# Altium schematic sheet Sheet1.SchDoc
size A0
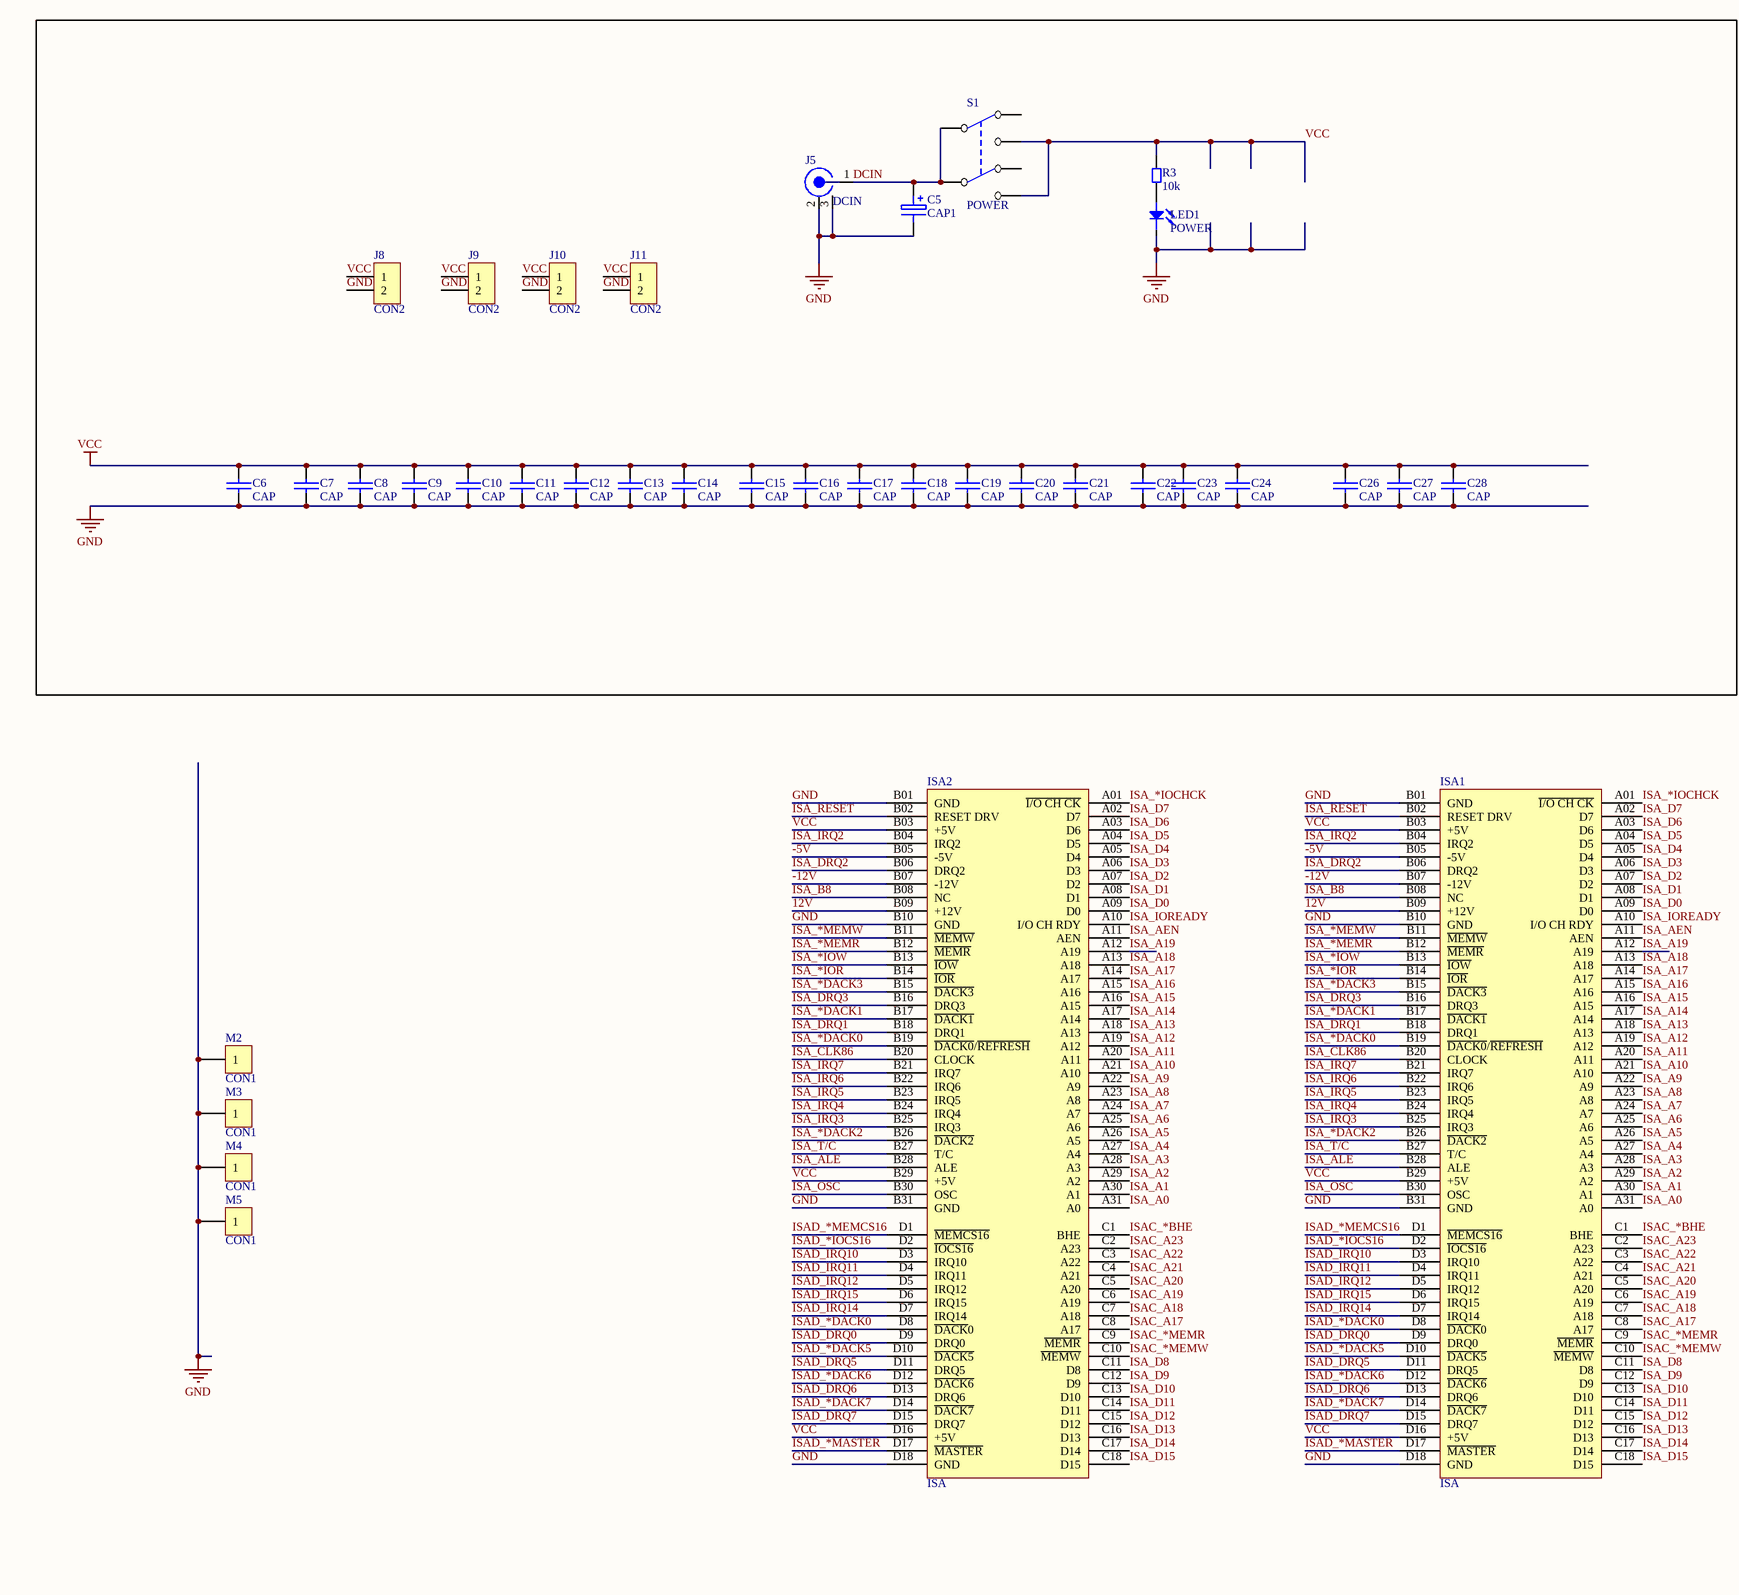
[diagram p0: Sheet1.SchDoc, left]
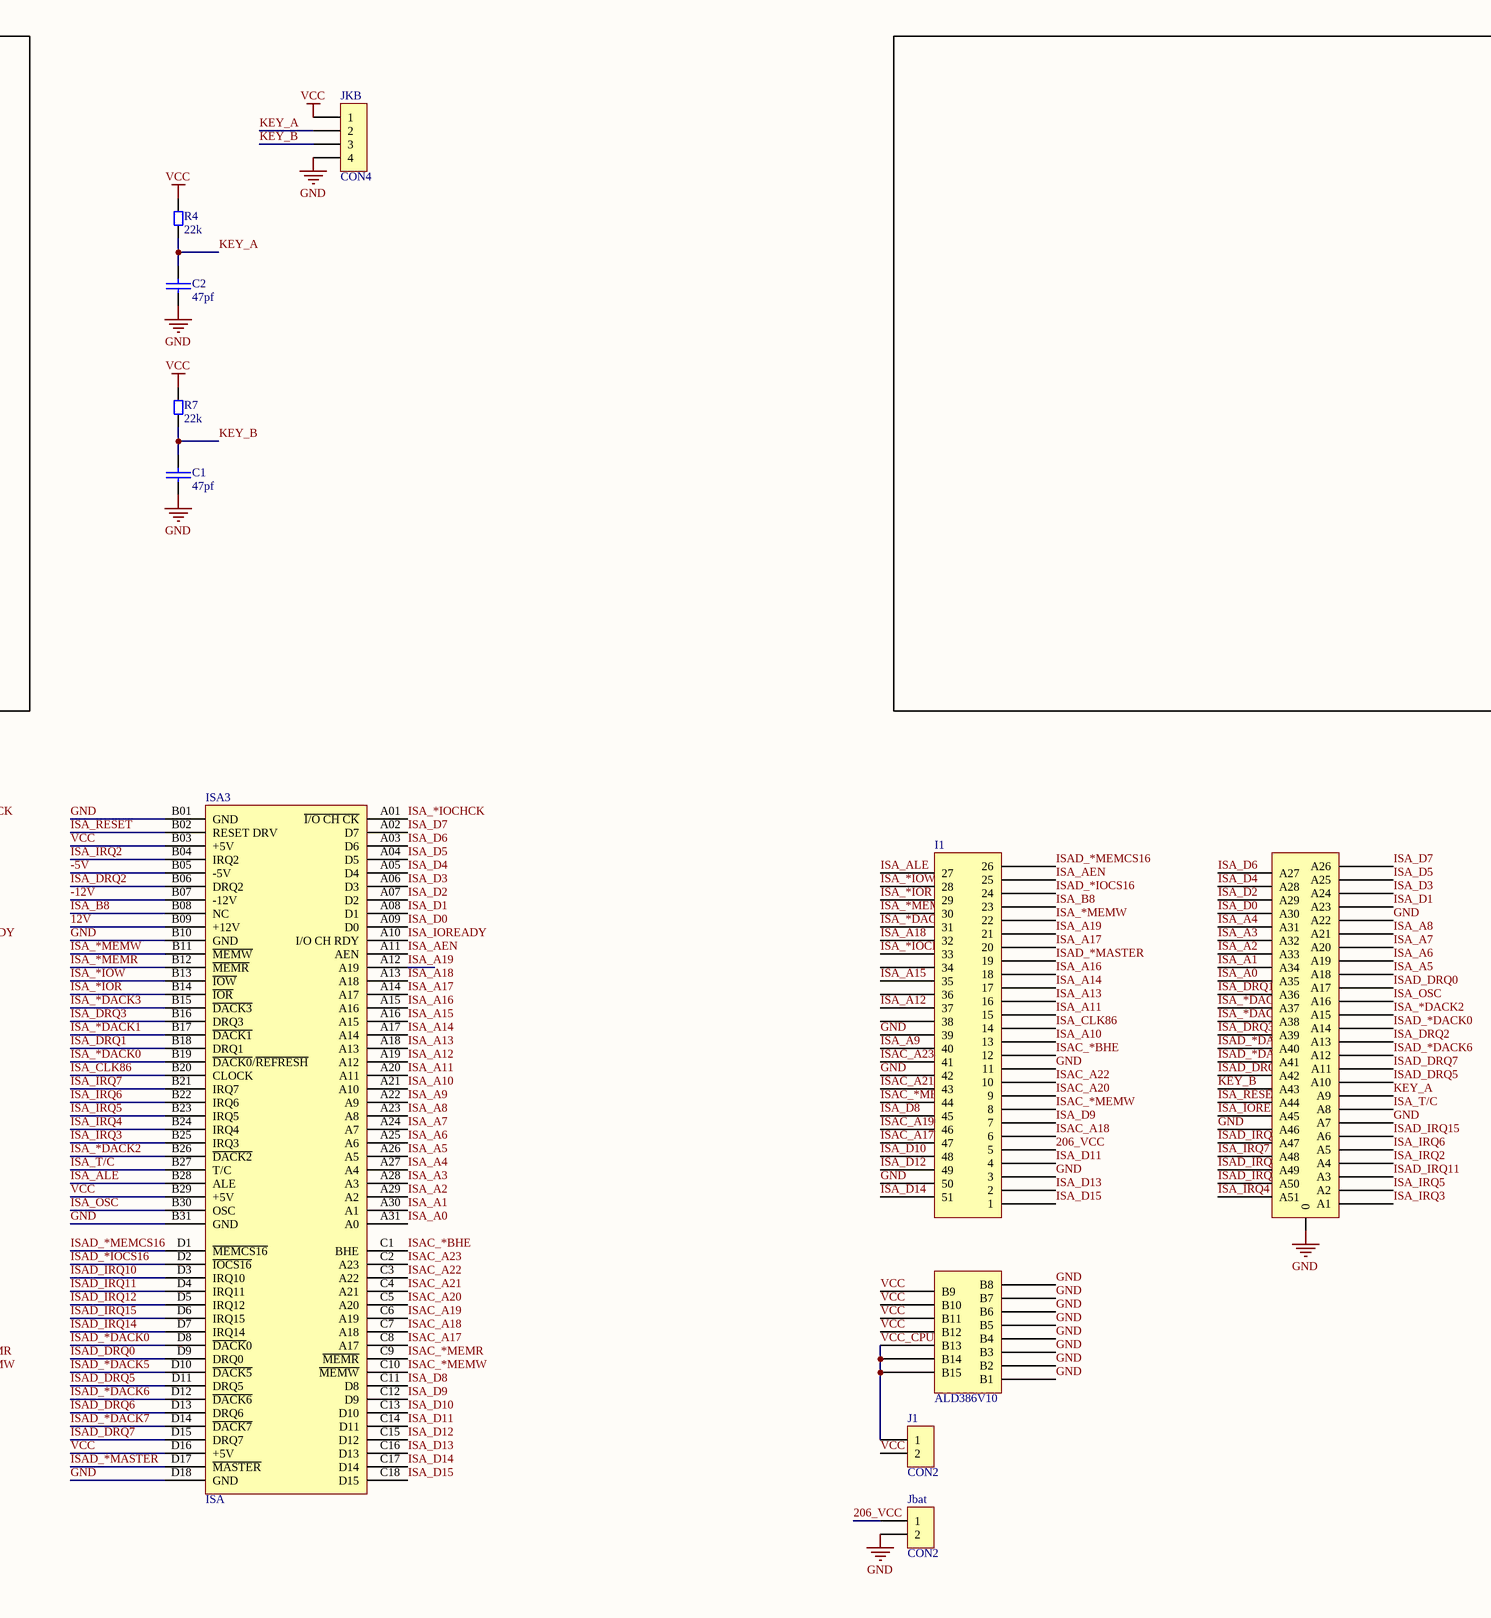
[diagram p1: Sheet1.SchDoc, middle]

## Parts
C1  47pf  [C0603]
C2  47pf  [C0603]
C5  CAP1  [RB.2/.4]
C6  CAP  [C0603]
C7  CAP  [C0603]
C8  CAP  [C0603]
C9  CAP  [C0603]
C10  CAP  [C0603]
C11  CAP  [C0603]
C12  CAP  [C0603]
C13  CAP  [C0603]
C14  CAP  [C0603]
C15  CAP  [C0603]
C16  CAP  [C0603]
C17  CAP  [C0603]
C18  CAP  [C0603]
C19  CAP  [C0603]
C20  CAP  [C0603]
C21  CAP  [C0603]
C22  CAP  [C0603]
C23  CAP  [C0603]
C24  CAP  [C0603]
C26  CAP  [C0603]
C27  CAP  [C0603]
C28  CAP  [C0603]
I1  ALD386V10  [MY-ALD386V10]
ISA1  ISA
ISA2  ISA
ISA3  ISA
J1  CON2  [SIP2]
J5  DCIN  [DC5.5-2.5]
J8  CON2  [SIP2]
J9  CON2  [SIP2]
J10  CON2  [SIP2]
J11  CON2  [SIP2]
Jbat  CON2  [XH2.54-2]
JKB  CON4  [XH2.54-4]
LED1  POWER  [LED0603]
M2  CON1  [M3]
M3  CON1  [M3]
M4  CON1  [M3]
M5  CON1  [M3]
R3  10k  [R0603]
R4  22k  [R0603]
R7  22k  [R0603]
S1  POWER  [SW 8x8]

## Nets
GND: C1.2 C2.2 C5.2(E) C6.2 C7.2 C8.2 C9.2 C10.2 C11.2 C12.2 C13.2 C14.2 C15.2 C16.2 C17.2 C18.2 C19.2 C20.2 C21.2 C22.2 C23.2 C24.2 C26.2 C27.2 C28.2 I1.0 I1.3 I1.11 I1.39 I1.42 I1.50 I1.A7 I1.A22 I1.A46 I1.B1 I1.B2 I1.B3 I1.B4 I1.B5 I1.B6 I1.B7 I1.B8 ISA1.B01(GND) ISA1.B10(GND) ISA1.B31(GND) ISA1.D18(GND) ISA2.B01(GND) ISA2.B10(GND) ISA2.B31(GND) ISA2.D18(GND) ISA3.B01(GND) ISA3.B10(GND) ISA3.B31(GND) ISA3.D18(GND) J5.2(-) J5.3(-) J8.2 J9.2 J10.2 J11.2 Jbat.2 JKB.4 LED1.2 M2.1 M3.1 M4.1 M5.1
VCC: C6.1 C7.1 C8.1 C9.1 C10.1 C11.1 C12.1 C13.1 C14.1 C15.1 C16.1 C17.1 C18.1 C19.1 C20.1 C21.1 C22.1 C23.1 C24.1 C26.1 C27.1 C28.1 I1.B9 I1.B10 I1.B11 I1.B12 ISA1.B03(+5V) ISA1.B29(+5V) ISA1.D16(+5V) ISA2.B03(+5V) ISA2.B29(+5V) ISA2.D16(+5V) ISA3.B03(+5V) ISA3.B29(+5V) ISA3.D16(+5V) J1.2 J8.1 J9.1 J10.1 J11.1 JKB.1 R3.2 R4.2 R7.2 S1.2(NC1) S1.5(COMMON2)
12V: ISA1.B09(+12V) ISA2.B09(+12V) ISA3.B09(+12V)
206_VCC: I1.5 Jbat.1
-5V: ISA1.B05(-5V) ISA2.B05(-5V) ISA3.B05(-5V)
-12V: ISA1.B07(-12V) ISA2.B07(-12V) ISA3.B07(-12V)
DCIN: C5.1 J5.1(+) S1.3(COMMON1) S1.6(NO2)
ISA_*DACK0: I1.31 ISA1.B19(~{DACK0}/~{REFRESH}) ISA2.B19(~{DACK0}/~{REFRESH}) ISA3.B19(~{DACK0}/~{REFRESH})
ISA_*DACK1: I1.A38 ISA1.B17(~{DACK1}) ISA2.B17(~{DACK1}) ISA3.B17(~{DACK1})
ISA_*DACK2: I1.A15 ISA1.B26(~{DACK2}) ISA2.B26(~{DACK2}) ISA3.B26(~{DACK2})
ISA_*DACK3: I1.A37 ISA1.B15(~{DACK3}) ISA2.B15(~{DACK3}) ISA3.B15(~{DACK3})
ISA_*IOCHCK: I1.33 ISA1.A01(~{I/O_CH_CK}) ISA2.A01(~{I/O_CH_CK}) ISA3.A01(~{I/O_CH_CK})
ISA_*IOR: I1.29 ISA1.B14(~{IOR}) ISA2.B14(~{IOR}) ISA3.B14(~{IOR})
ISA_*IOW: I1.28 ISA1.B13(~{IOW}) ISA2.B13(~{IOW}) ISA3.B13(~{IOW})
ISA_*MEMR: I1.30 ISA1.B12(~{MEMR}) ISA2.B12(~{MEMR}) ISA3.B12(~{MEMR})
ISA_*MEMW: I1.22 ISA1.B11(~{MEMW}) ISA2.B11(~{MEMW}) ISA3.B11(~{MEMW})
ISA_A0: I1.A35 ISA1.A31(A0) ISA2.A31(A0) ISA3.A31(A0)
ISA_A1: I1.A34 ISA1.A30(A1) ISA2.A30(A1) ISA3.A30(A1)
ISA_A2: I1.A33 ISA1.A29(A2) ISA2.A29(A2) ISA3.A29(A2)
ISA_A3: I1.A32 ISA1.A28(A3) ISA2.A28(A3) ISA3.A28(A3)
ISA_A4: I1.A31 ISA1.A27(A4) ISA2.A27(A4) ISA3.A27(A4)
ISA_A5: I1.A18 ISA1.A26(A5) ISA2.A26(A5) ISA3.A26(A5)
ISA_A6: I1.A19 ISA1.A25(A6) ISA2.A25(A6) ISA3.A25(A6)
ISA_A7: I1.A20 ISA1.A24(A7) ISA2.A24(A7) ISA3.A24(A7)
ISA_A8: I1.A21 ISA1.A23(A8) ISA2.A23(A8) ISA3.A23(A8)
ISA_A9: I1.40 ISA1.A22(A9) ISA2.A22(A9) ISA3.A22(A9)
ISA_A10: I1.13 ISA1.A21(A10) ISA2.A21(A10) ISA3.A21(A10)
ISA_A11: I1.15 ISA1.A20(A11) ISA2.A20(A11) ISA3.A20(A11)
ISA_A12: I1.37 ISA1.A19(A12) ISA2.A19(A12) ISA3.A19(A12)
ISA_A13: I1.16 ISA1.A18(A13) ISA2.A18(A13) ISA3.A18(A13)
ISA_A14: I1.17 ISA1.A17(A14) ISA2.A17(A14) ISA3.A17(A14)
ISA_A15: I1.35 ISA1.A16(A15) ISA2.A16(A15) ISA3.A16(A15)
ISA_A16: I1.18 ISA1.A15(A16) ISA2.A15(A16) ISA3.A15(A16)
ISA_A17: I1.20 ISA1.A14(A17) ISA2.A14(A17) ISA3.A14(A17)
ISA_A18: I1.32 ISA1.A13(A18) ISA2.A13(A18) ISA3.A13(A18)
ISA_A19: I1.21 ISA1.A12(A19) ISA2.A12(A19) ISA3.A12(A19)
ISA_AEN: I1.25 ISA1.A11(AEN) ISA2.A11(AEN) ISA3.A11(AEN)
ISA_ALE: I1.27 ISA1.B28(ALE) ISA2.B28(ALE) ISA3.B28(ALE)
ISA_B8: I1.23 ISA1.B08(NC) ISA2.B08(NC) ISA3.B08(NC)
ISA_CLK86: I1.14 ISA1.B20(CLOCK) ISA2.B20(CLOCK) ISA3.B20(CLOCK)
ISA_D0: I1.A30 ISA1.A09(D0) ISA2.A09(D0) ISA3.A09(D0)
ISA_D1: I1.A23 ISA1.A08(D1) ISA2.A08(D1) ISA3.A08(D1)
ISA_D2: I1.A29 ISA1.A07(D2) ISA2.A07(D2) ISA3.A07(D2)
ISA_D3: I1.A24 ISA1.A06(D3) ISA2.A06(D3) ISA3.A06(D3)
ISA_D4: I1.A28 ISA1.A05(D4) ISA2.A05(D4) ISA3.A05(D4)
ISA_D5: I1.A25 ISA1.A04(D5) ISA2.A04(D5) ISA3.A04(D5)
ISA_D6: I1.A27 ISA1.A03(D6) ISA2.A03(D6) ISA3.A03(D6)
ISA_D7: I1.A26 ISA1.A02(D7) ISA2.A02(D7) ISA3.A02(D7)
ISA_D8: I1.45 ISA1.C11(D8) ISA2.C11(D8) ISA3.C11(D8)
ISA_D9: I1.7 ISA1.C12(D9) ISA2.C12(D9) ISA3.C12(D9)
ISA_D10: I1.48 ISA1.C13(D10) ISA2.C13(D10) ISA3.C13(D10)
ISA_D11: I1.4 ISA1.C14(D11) ISA2.C14(D11) ISA3.C14(D11)
ISA_D12: I1.49 ISA1.C15(D12) ISA2.C15(D12) ISA3.C15(D12)
ISA_D13: I1.2 ISA1.C16(D13) ISA2.C16(D13) ISA3.C16(D13)
ISA_D14: I1.51 ISA1.C17(D14) ISA2.C17(D14) ISA3.C17(D14)
ISA_D15: I1.1 ISA1.C18(D15) ISA2.C18(D15) ISA3.C18(D15)
ISA_DRQ1: I1.A36 ISA1.B18(DRQ1) ISA2.B18(DRQ1) ISA3.B18(DRQ1)
ISA_DRQ2: I1.A13 ISA1.B06(DRQ2) ISA2.B06(DRQ2) ISA3.B06(DRQ2)
ISA_DRQ3: I1.A39 ISA1.B16(DRQ3) ISA2.B16(DRQ3) ISA3.B16(DRQ3)
ISA_IOREADY: I1.A45 ISA1.A10(I/O_CH_RDY) ISA2.A10(I/O_CH_RDY) ISA3.A10(I/O_CH_RDY)
ISA_IRQ2: I1.A4 ISA1.B04(IRQ2) ISA2.B04(IRQ2) ISA3.B04(IRQ2)
ISA_IRQ3: I1.A1 ISA1.B25(IRQ3) ISA2.B25(IRQ3) ISA3.B25(IRQ3)
ISA_IRQ4: I1.A51 ISA1.B24(IRQ4) ISA2.B24(IRQ4) ISA3.B24(IRQ4)
ISA_IRQ5: I1.A2 ISA1.B23(IRQ5) ISA2.B23(IRQ5) ISA3.B23(IRQ5)
ISA_IRQ6: I1.A5 ISA1.B22(IRQ6) ISA2.B22(IRQ6) ISA3.B22(IRQ6)
ISA_IRQ7: I1.A48 ISA1.B21(IRQ7) ISA2.B21(IRQ7) ISA3.B21(IRQ7)
ISA_OSC: I1.A16 ISA1.B30(OSC) ISA2.B30(OSC) ISA3.B30(OSC)
ISA_RESET: I1.A44 ISA1.B02(RESET_DRV) ISA2.B02(RESET_DRV) ISA3.B02(RESET_DRV)
ISA_T/C: I1.A8 ISA1.B27(T/C) ISA2.B27(T/C) ISA3.B27(T/C)
ISAC_*BHE: I1.12 ISA1.C1(BHE) ISA2.C1(BHE) ISA3.C1(BHE)
ISAC_*MEMR: I1.44 ISA1.C9(~{MEMR}) ISA2.C9(~{MEMR}) ISA3.C9(~{MEMR})
ISAC_*MEMW: I1.8 ISA1.C10(~{MEMW}) ISA2.C10(~{MEMW}) ISA3.C10(~{MEMW})
ISAC_A17: I1.47 ISA1.C8(A17) ISA2.C8(A17) ISA3.C8(A17)
ISAC_A18: I1.6 ISA1.C7(A18) ISA2.C7(A18) ISA3.C7(A18)
ISAC_A19: I1.46 ISA1.C6(A19) ISA2.C6(A19) ISA3.C6(A19)
ISAC_A20: I1.9 ISA1.C5(A20) ISA2.C5(A20) ISA3.C5(A20)
ISAC_A21: I1.43 ISA1.C4(A21) ISA2.C4(A21) ISA3.C4(A21)
ISAC_A22: I1.10 ISA1.C3(A22) ISA2.C3(A22) ISA3.C3(A22)
ISAC_A23: I1.41 ISA1.C2(A23) ISA2.C2(A23) ISA3.C2(A23)
ISAD_*DACK0: I1.A14 ISA1.D8(~{DACK}0) ISA2.D8(~{DACK}0) ISA3.D8(~{DACK}0)
ISAD_*DACK5: I1.A41 ISA1.D10(~{DACK5}) ISA2.D10(~{DACK5}) ISA3.D10(~{DACK5})
ISAD_*DACK6: I1.A12 ISA1.D12(~{DACK6}) ISA2.D12(~{DACK6}) ISA3.D12(~{DACK6})
ISAD_*DACK7: I1.A40 ISA1.D14(~{DACK7}) ISA2.D14(~{DACK7}) ISA3.D14(~{DACK7})
ISAD_*IOCS16: I1.24 ISA1.D2(~{IOCS16}) ISA2.D2(~{IOCS16}) ISA3.D2(~{IOCS16})
ISAD_*MASTER: I1.19 ISA1.D17(~{MASTER}) ISA2.D17(~{MASTER}) ISA3.D17(~{MASTER})
ISAD_*MEMCS16: I1.26 ISA1.D1(~{MEMCS16}) ISA2.D1(~{MEMCS16}) ISA3.D1(~{MEMCS16})
ISAD_DRQ0: I1.A17 ISA1.D9(DRQ0) ISA2.D9(DRQ0) ISA3.D9(DRQ0)
ISAD_DRQ5: I1.A10 ISA1.D11(DRQ5) ISA2.D11(DRQ5) ISA3.D11(DRQ5)
ISAD_DRQ6: I1.A42 ISA1.D13(DRQ6) ISA2.D13(DRQ6) ISA3.D13(DRQ6)
ISAD_DRQ7: I1.A11 ISA1.D15(DRQ7) ISA2.D15(DRQ7) ISA3.D15(DRQ7)
ISAD_IRQ10: I1.A49 ISA1.D3(IRQ10) ISA2.D3(IRQ10) ISA3.D3(IRQ10)
ISAD_IRQ11: I1.A3 ISA1.D4(IRQ11) ISA2.D4(IRQ11) ISA3.D4(IRQ11)
ISAD_IRQ12: I1.A50 ISA1.D5(IRQ12) ISA2.D5(IRQ12) ISA3.D5(IRQ12)
ISAD_IRQ14: I1.A47 ISA1.D7(IRQ14) ISA2.D7(IRQ14) ISA3.D7(IRQ14)
ISAD_IRQ15: I1.A6 ISA1.D6(IRQ15) ISA2.D6(IRQ15) ISA3.D6(IRQ15)
KEY_A: C2.1 I1.A9 JKB.2 R4.1
KEY_B: C1.1 I1.A43 JKB.3 R7.1
VCC_CPU: I1.B13 I1.B14 I1.B15 J1.1
NetLED1_1: LED1.1 R3.1

Not connected (* = marked no-connect by the designer): I1 34 36 38; S1 1(NO1) 4(NC2)

## Library data of the parts
C1 C2 = CAP
J5 = DCIN: Connector
LED1 = LED
R3 R4 R7 = RES2
S1 = 双刀双柄开关